# EAGLE schematic esquema001 (EAGLE 7.2.0)

## Sheet 1 of 4: Buffer
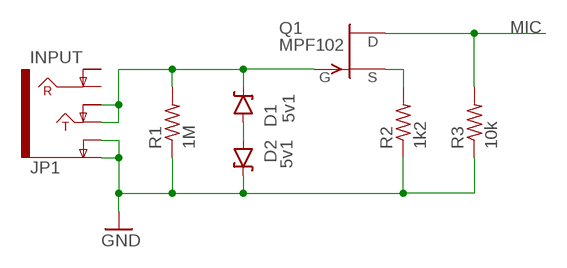
[diagram p0: schematic, sheet 1]

### Parts
D1  5v1  DIODE-ZENERPTH  [DIODE-ZENER]
D2  5v1  DIODE-ZENERPTH  [DIODE-ZENER]
JP1  INPUT  AUDIO-JACK4-.25-HORIZ-TRS  [AUDIO-JACK-.25-INCH-HORIZ-PTH]
Q1  MPF102  2N5484  [TO92-]
R1  1M  R-US_0204/7  [0204/7]
R2  1k2  R-US_0204/7  [0204/7]
R3  10k  R-US_0204/7  [0204/7]

### Nets
GND: D2.P$1(C) JP1.SLEEVE(EARTH) JP1.SLEEVE-NORM(EARTH-NORM) R1.1 R2.1 R3.1 ; also sheet 2,3,4
MIC: Q1.3(D) R3.2
N$1: D1.P$2(A) D2.P$2(A)
N$2: D1.P$1(C) JP1.TIP JP1.TIP-NORM Q1.1(G) R1.2
N$3: Q1.2(S) R2.2
Unconnected: JP1.RING JP1.RING-NORM

## Sheet 2 of 4: Headphone
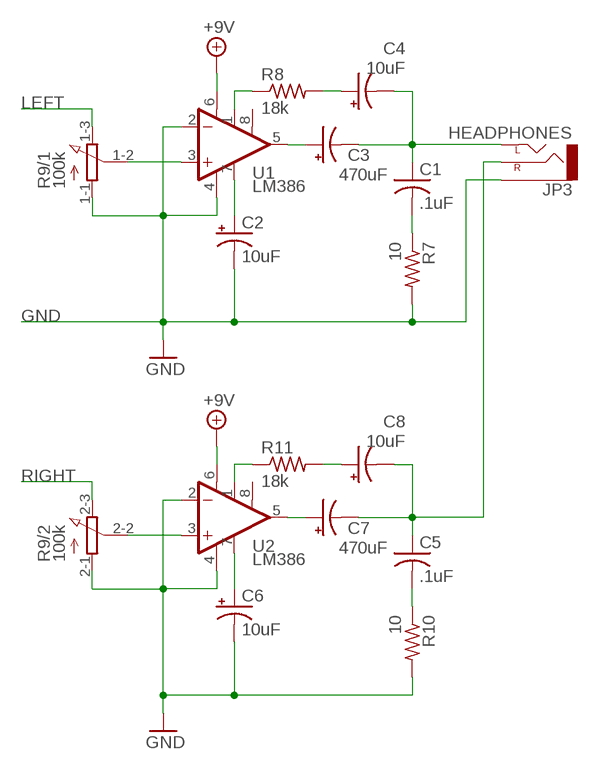
[diagram p1: schematic, sheet 2]

### Parts
C1  .1uF  C-US050-024X044  [C050-024X044]
C2  10uF  CPOL-USE2.5-7  [E2,5-7]
C3  470uF  CPOL-USE2.5-7  [E2,5-7]
C4  10uF  CPOL-USE2.5-7  [E2,5-7]
C5  .1uF  C-US050-024X044  [C050-024X044]
C6  10uF  CPOL-USE2.5-7  [E2,5-7]
C7  470uF  CPOL-USE2.5-7  [E2,5-7]
C8  10uF  CPOL-USE2.5-7  [E2,5-7]
JP3  HEADPHONES  AUDIO-JACKPTH  [AUDIO-JACK]
R7  10  R-US_0204/7  [0204/7]
R8  18k  R-US_0204/7  [0204/7]
R9  100k  3RP/1610G  [3RP/1610G]
R10  10  R-US_0204/7  [0204/7]
R11  18k  R-US_0204/7  [0204/7]
U1  LM386  [DIP08]
U2  LM386  [DIP08]

### Nets
+9V: U1.6(V+) U2.6(V+) ; also sheet 4
GND: C2.- C6.- JP3.SLEEVE R7.2 R9.1-1(/1:A) R9.2-1(/2:A) R10.2 U1.2(-IN) U1.4(V-) U2.2(-IN) U2.4(V-) ; also sheet 1,3,4
LEFT: R9.1-3(/1:E) ; also sheet 3
N$5: C2.+ U1.7(BP)
N$6: C3.+ U1.5(OUT)
N$7: R9.1-2(/1:S) U1.3(+IN)
N$8: C1.2 R7.1
N$9: C1.1 C3.- C4.- JP3.TIP(LEFT)
N$11: C4.+ R8.2
N$13: R8.1 U1.1(GAIN)
N$14: C6.+ U2.7(BP)
N$15: R9.2-2(/2:S) U2.3(+IN)
N$16: C7.+ U2.5(OUT)
N$17: C5.2 R10.1
N$18: C5.1 C7.- C8.- JP3.RING(RIGHT)
N$19: C8.+ R11.2
N$20: R11.1 U2.1(GAIN)
RIGHT: R9.2-3(/2:E) ; also sheet 3
Unconnected: U1.8(GAIN) U2.8(GAIN)

## Sheet 3 of 4: Output
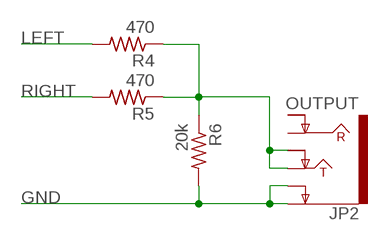
[diagram p2: schematic, sheet 3]

### Parts
JP2  OUTPUT  AUDIO-JACK4-.25-HORIZ-TRS  [AUDIO-JACK-.25-INCH-HORIZ-PTH]
R4  470  R-US_0204/7  [0204/7]
R5  470  R-US_0204/7  [0204/7]
R6  20k  R-US_0204/7  [0204/7]

### Nets
GND: JP2.SLEEVE(EARTH) JP2.SLEEVE-NORM(EARTH-NORM) R6.2 ; also sheet 1,2,4
LEFT: R4.2 ; also sheet 2
N$4: JP2.TIP JP2.TIP-NORM R4.1 R5.1 R6.1
RIGHT: R5.2 ; also sheet 2
Unconnected: JP2.RING JP2.RING-NORM

## Sheet 4 of 4: POWER
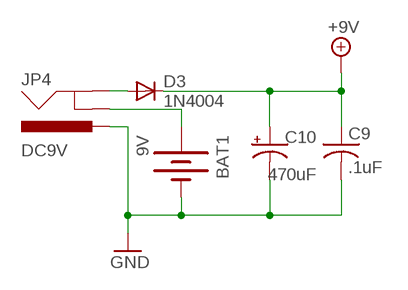
[diagram p3: schematic, sheet 4]

### Parts
BAT1  9V  BATTERY9V  [BATTCON_9V]
C9  .1uF  C-US050-024X044  [C050-024X044]
C10  470uF  CPOL-USE2.5-7  [E2,5-7]
D3  1N4004  [DO41-10]
JP4  DC9V  POWER_JACKPTH  [POWER_JACK_PTH]

### Nets
+9V: C9.1 C10.+ D3.C ; also sheet 2
GND: BAT1.- C9.2 C10.- JP4.PWR ; also sheet 1,2,3
N$10: D3.A JP4.GND
N$21: BAT1.+ JP4.GNDBREAK

## Library data of the parts
BAT1 = SparkFun-Electromechanical:BATTERY: Battery Holders Various common sizes : AA, AAA, 18650 (PRT-12895), 20mm coin cell and 12mm coin cell. 20MM_4LEGS, BATT-10373
C1 C5 C9 = adafruit:C-US: CAPACITOR, American symbol
C2-C4 C6-C8 C10 = adafruit:CPOL-US: POLARIZED CAPACITOR, American symbol
D1 D2 = SparkFun-DiscreteSemi:DIODE-ZENER: Zener Diode Production Part - 8199 3.4V Zener Voltage
D3 = adafruit:1N4004: DIODE General purpose 1N400x type rectifier (With bigger pads) http://www.ladyada.net/library/pcb/eaglelibrary.html
JP1 JP2 = SparkFun-Connectors:AUDIO-JACK4-.25-HORIZ-TRS: 1/4" TRS jack, horizontal Production SKU: COM-11144 Footprint unproven - datasheet and part seem to be slightly different; PROD_ID: COM-11144
JP3 = SparkFun-Connectors:AUDIO-JACK: 3.5mm Audio Jack Simple 3.5mm common PCB mount audio jack. Variant PTH is our storefront SKU PRT-08032
JP4 = SparkFun-Connectors:POWER_JACK: Power Jack This is the standard 5.5mm barrel jack for power. The PTH is the most common, proven, reliable, footprint. The Slot footprint only works if the mill layer is transmitted to the PCB fab house so be warned. Mating wall wart : TOL-00298 (and others); PROD_ID: CONN-08197
Q1 = transistor-fet:?548*: N-Channel JFETs Source: VISHAY 2N5484.pdf Compatible: TO92 2N5245 J304 J305 U310 J308 J309 J310 TO72 2N4416 2N4416A 2N3823 2N4351 3N169 3N170 3N171 MFE3002 TO18 2N3796 2N3797 MFE825 Source: Motorola European Master Guide Pacge 3-59
R1-R8 R10 R11 = rcl:R-US_: RESISTOR, American symbol
R9 = pot:3RP/1610G: 16mm Potentiometer two level Source: http://www.alphapotentiometers.net/html/16mm_pot_2.html
U1 U2 = SparkFun-AnalogIC:LM386: low voltage audio power amplifier